# EAGLE design Preen40 (EAGLE 6.5.0)
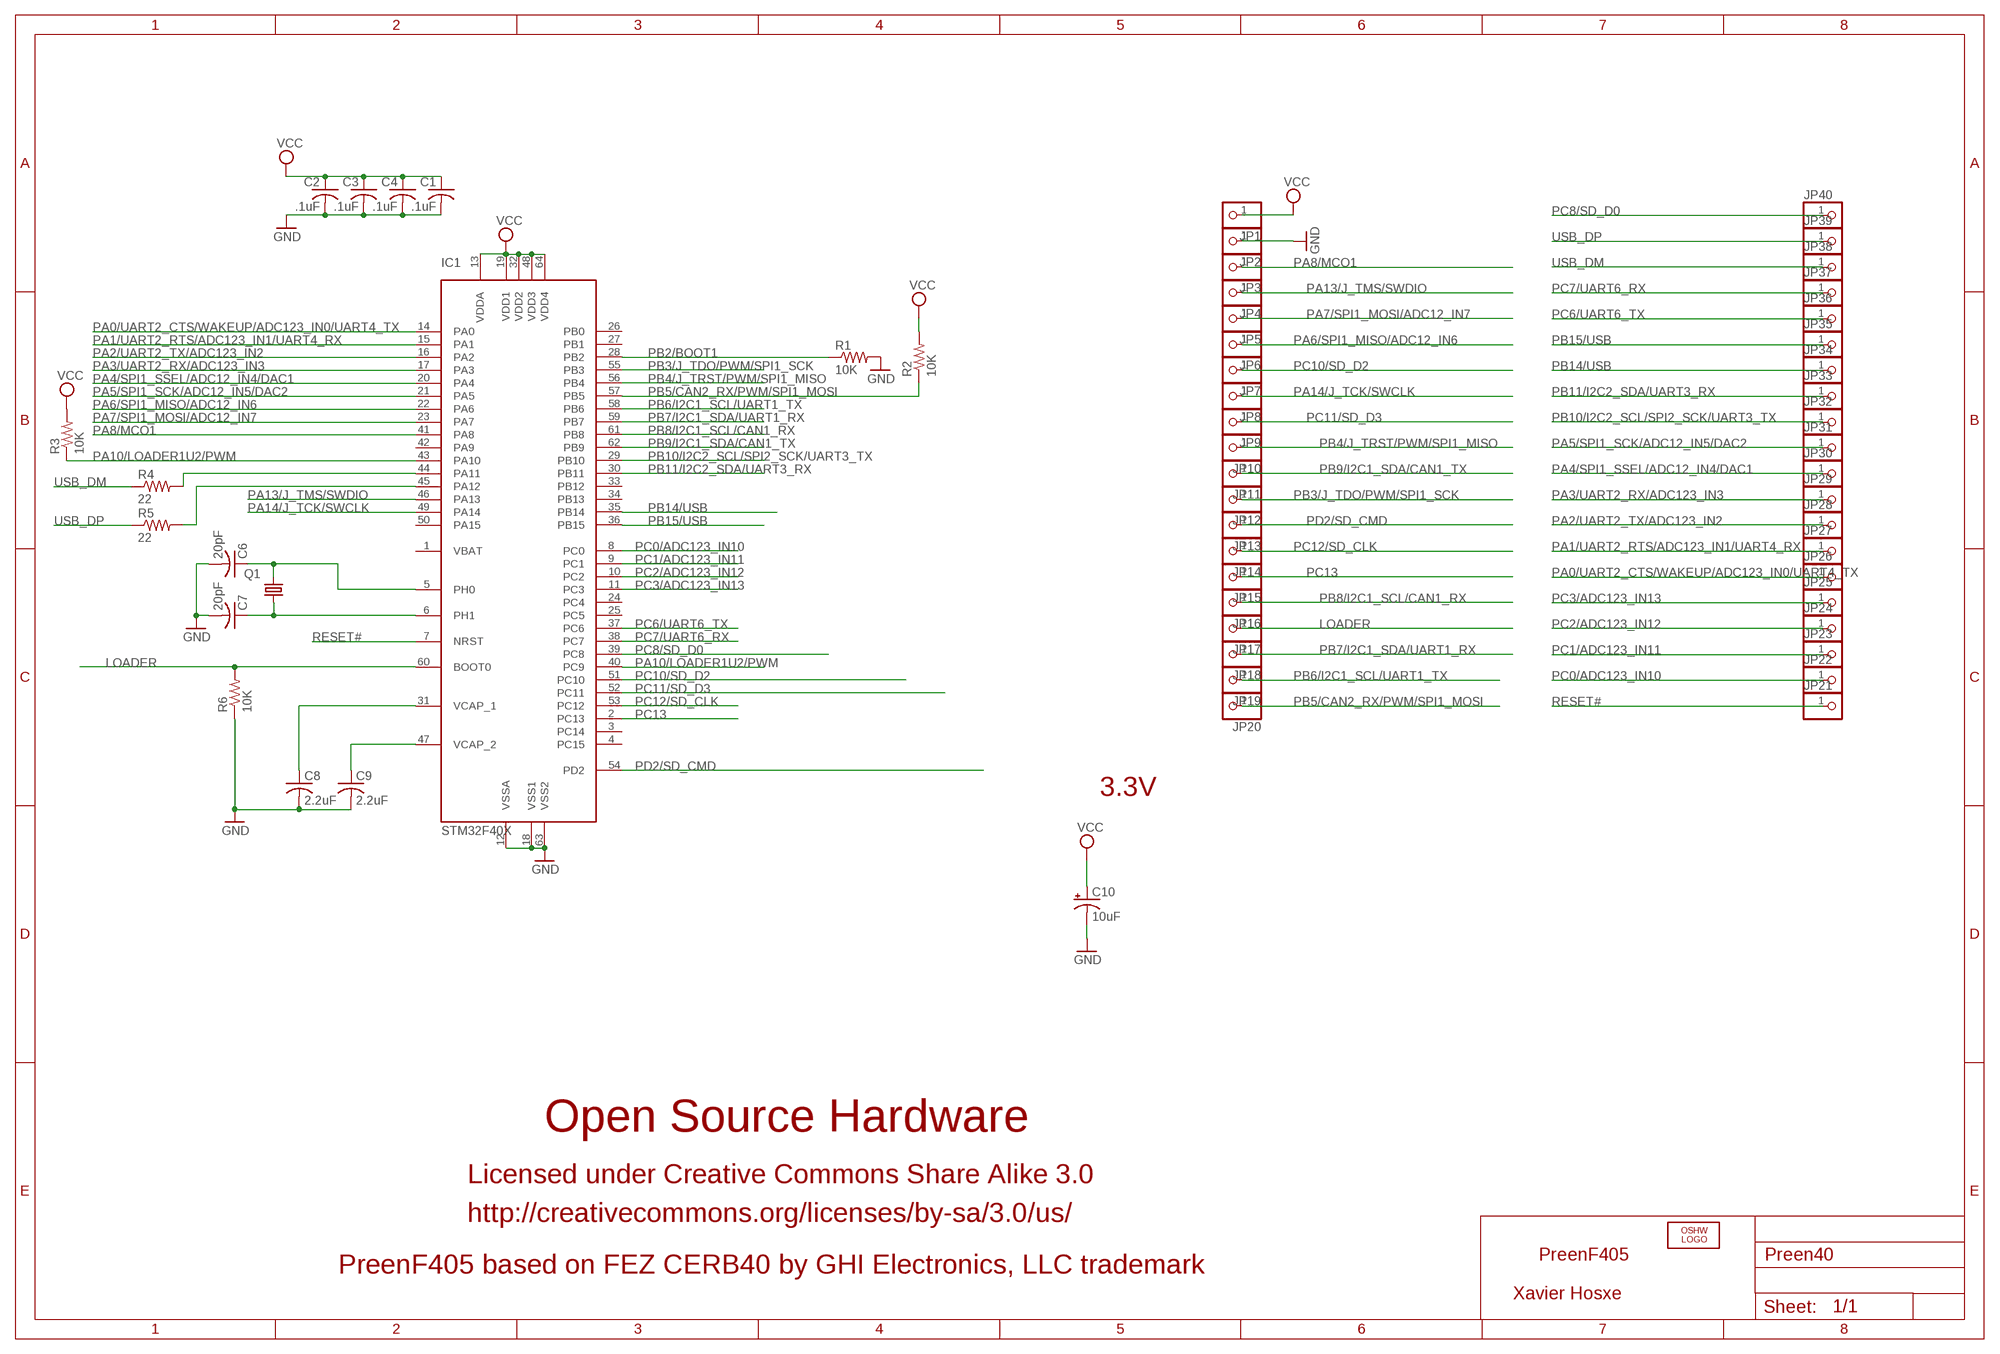
[diagram p0: schematic, sheet 1]

## Parts
C1  .1uF  C-USC0603K  [C0603K]
C2  .1uF  C-USC0603K  [C0603K]
C3  .1uF  C-USC0603K  [C0603K]
C4  .1uF  C-USC0603K  [C0603K]
C6  20pF  C-USC0603K  [C0603K]
C7  20pF  C-USC0603K  [C0603K]
C8  2.2uF  C-USC0805K  [C0805K]
C9  2.2uF  C-USC0805K  [C0805K]
C10  10uF  CPOL-USCT3528  [CT3528]
IC1  STM32F40X  [LQFP64]
JP1  PINHD-1X1  [1X01]
JP2  PINHD-1X1  [1X01]
JP3  PINHD-1X1  [1X01]
JP4  PINHD-1X1  [1X01]
JP5  PINHD-1X1  [1X01]
JP6  PINHD-1X1  [1X01]
JP7  PINHD-1X1  [1X01]
JP8  PINHD-1X1  [1X01]
JP9  PINHD-1X1  [1X01]
JP10  PINHD-1X1  [1X01]
JP11  PINHD-1X1  [1X01]
JP12  PINHD-1X1  [1X01]
JP13  PINHD-1X1  [1X01]
JP14  PINHD-1X1  [1X01]
JP15  PINHD-1X1  [1X01]
JP16  PINHD-1X1  [1X01]
JP17  PINHD-1X1  [1X01]
JP18  PINHD-1X1  [1X01]
JP19  PINHD-1X1  [1X01]
JP20  PINHD-1X1  [1X01]
JP21  PINHD-1X1  [1X01]
JP22  PINHD-1X1  [1X01]
JP23  PINHD-1X1  [1X01]
JP24  PINHD-1X1  [1X01]
JP25  PINHD-1X1  [1X01]
JP26  PINHD-1X1  [1X01]
JP27  PINHD-1X1  [1X01]
JP28  PINHD-1X1  [1X01]
JP29  PINHD-1X1  [1X01]
JP30  PINHD-1X1  [1X01]
JP31  PINHD-1X1  [1X01]
JP32  PINHD-1X1  [1X01]
JP33  PINHD-1X1  [1X01]
JP34  PINHD-1X1  [1X01]
JP35  PINHD-1X1  [1X01]
JP36  PINHD-1X1  [1X01]
JP37  PINHD-1X1  [1X01]
JP38  PINHD-1X1  [1X01]
JP39  PINHD-1X1  [1X01]
JP40  PINHD-1X1  [1X01]
LOGO1  LOGO-OSHW-FILLX0200-NT  [OSHW_FILLX200_NOTEXT]
Q1  12Mhz  CRYTALSM49  [SM49@1]
R1  10K  R-US_R0603  [R0603]
R2  10K  R-US_R0603  [R0603]
R3  10K  R-US_R0603  [R0603]
R4  22  R-US_R0603  [R0603]
R5  22  R-US_R0603  [R0603]
R6  10K  R-US_R0603  [R0603]

## Nets
GND [power]: C1.2 C2.2 C3.2 C4.2 C6.2 C7.2 C8.2 C9.2 C10.- IC1.12(VSSA) IC1.18(VSS1) IC1.63(VSS2) JP2.1 R1.2 R6.1
LOADER: IC1.60(BOOT0) JP17.1 R6.2
N$2: C9.1 IC1.47(VCAP_2)
N$3: C8.1 IC1.31(VCAP_1)
N$5: IC1.44(PA11) R4.2
N$7: IC1.45(PA12) R5.2
PA0/UART2_CTS/WAKEUP/ADC123_IN0/UART4_TX: IC1.14(PA0) JP26.1
PA1/UART2_RTS/ADC123_IN1/UART4_RX: IC1.15(PA1) JP27.1
PA2/UART2_TX/ADC123_IN2: IC1.16(PA2) JP28.1
PA3/UART2_RX/ADC123_IN3: IC1.17(PA3) JP29.1
PA4/SPI1_SSEL/ADC12_IN4/DAC1: IC1.20(PA4) JP30.1
PA5/SPI1_SCK/ADC12_IN5/DAC2: IC1.21(PA5) JP31.1
PA6/SPI1_MISO/ADC12_IN6: IC1.22(PA6) JP6.1
PA7/SPI1_MOSI/ADC12_IN7: IC1.23(PA7) JP5.1
PA8/MCO1: IC1.41(PA8) JP3.1
PA10/LOADER1U2/PWM: IC1.40(PC9) IC1.43(PA10) R3.1
PA13/J_TMS/SWDIO: IC1.46(PA13) JP4.1
PA14/J_TCK/SWCLK: IC1.49(PA14) JP8.1
PB2/BOOT1: IC1.28(PB2) R1.1
PB3/J_TDO/PWM/SPI1_SCK: IC1.55(PB3) JP12.1
PB4/J_TRST/PWM/SPI1_MISO: IC1.56(PB4) JP10.1
PB5/CAN2_RX/PWM/SPI1_MOSI: IC1.57(PB5) JP20.1 R2.1
PB6/I2C1_SCL/UART1_TX: IC1.58(PB6) JP19.1
PB7/I2C1_SDA/UART1_RX: IC1.59(PB7) JP18.1
PB8/I2C1_SCL/CAN1_RX: IC1.61(PB8) JP16.1
PB9/I2C1_SDA/CAN1_TX: IC1.62(PB9) JP11.1
PB10/I2C2_SCL/SPI2_SCK/UART3_TX: IC1.29(PB10) JP32.1
PB11/I2C2_SDA/UART3_RX: IC1.30(PB11) JP33.1
PB14/USB: IC1.35(PB14) JP34.1
PB15/USB: IC1.36(PB15) JP35.1
PC0/ADC123_IN10: IC1.8(PC0) JP22.1
PC1/ADC123_IN11: IC1.9(PC1) JP23.1
PC2/ADC123_IN12: IC1.10(PC2) JP24.1
PC3/ADC123_IN13: IC1.11(PC3) JP25.1
PC6/UART6_TX: IC1.37(PC6) JP36.1
PC7/UART6_RX: IC1.38(PC7) JP37.1
PC8/SD_D0: IC1.39(PC8) JP40.1
PC10/SD_D2: IC1.51(PC10) JP7.1
PC11/SD_D3: IC1.52(PC11) JP9.1
PC12/SD_CLK: IC1.53(PC12) JP14.1
PC13: IC1.2(PC13) JP15.1
PD2/SD_CMD: IC1.54(PD2) JP13.1
RESET#: IC1.7(NRST) JP21.1
USB_DM: JP38.1 R4.1
USB_DP: JP39.1 R5.1
VCC [power]: C1.1 C2.1 C3.1 C4.1 C10.+ IC1.13(VDDA) IC1.19(VDD1) IC1.32(VDD2) IC1.48(VDD3) IC1.64(VDD4) JP1.1 R2.2 R3.2
XTAL3: C6.1 IC1.5(PH0) Q1.2
XTAL4: C7.1 IC1.6(PH1) Q1.1
Unconnected: IC1.1(VBAT) IC1.3(PC14) IC1.4(PC15) IC1.24(PC4) IC1.25(PC5) IC1.26(PB0) IC1.27(PB1) IC1.33(PB12) IC1.34(PB13) IC1.42(PA9) IC1.50(PA15)

## Notes on the sheet
- 3.3V
- Open Source Hardware
- Licensed under Creative Commons Share Alike 3.0
- http://creativecommons.org/licenses/by-sa/3.0/us/
- PreenF405
- PreenF405 based on FEZ CERB40 by GHI Electronics, LLC trademark
- Xavier Hosxe

## Library data of the parts
C1-C4 C6-C9 = rcl:C-US: CAPACITOR, American symbol
C10 = rcl:CPOL-US: POLARIZED CAPACITOR, American symbol
IC1 = GHI:STM32F40X
JP1-JP40 = pinhead:PINHD-1X1: PIN HEADER
LOGO1 = Logo:LOGO-OSHW-FILL
Q1 = crystal:CRYTAL: CRYSTAL
R1-R6 = rcl:R-US_: RESISTOR, American symbol

## Board
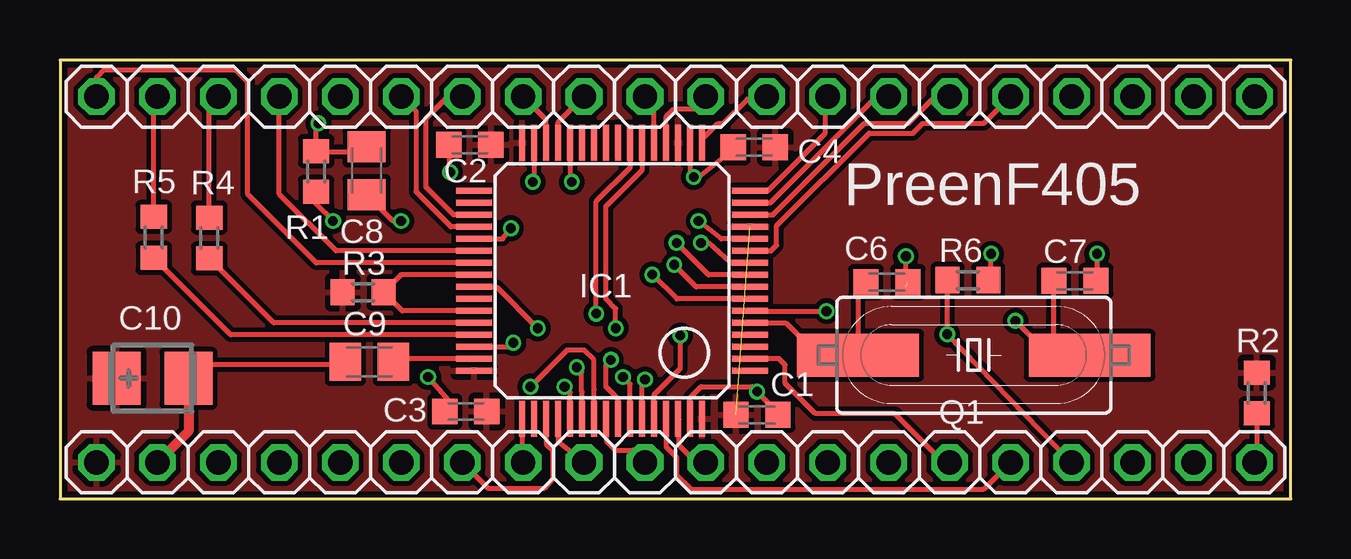
[diagram p1: board, top side]
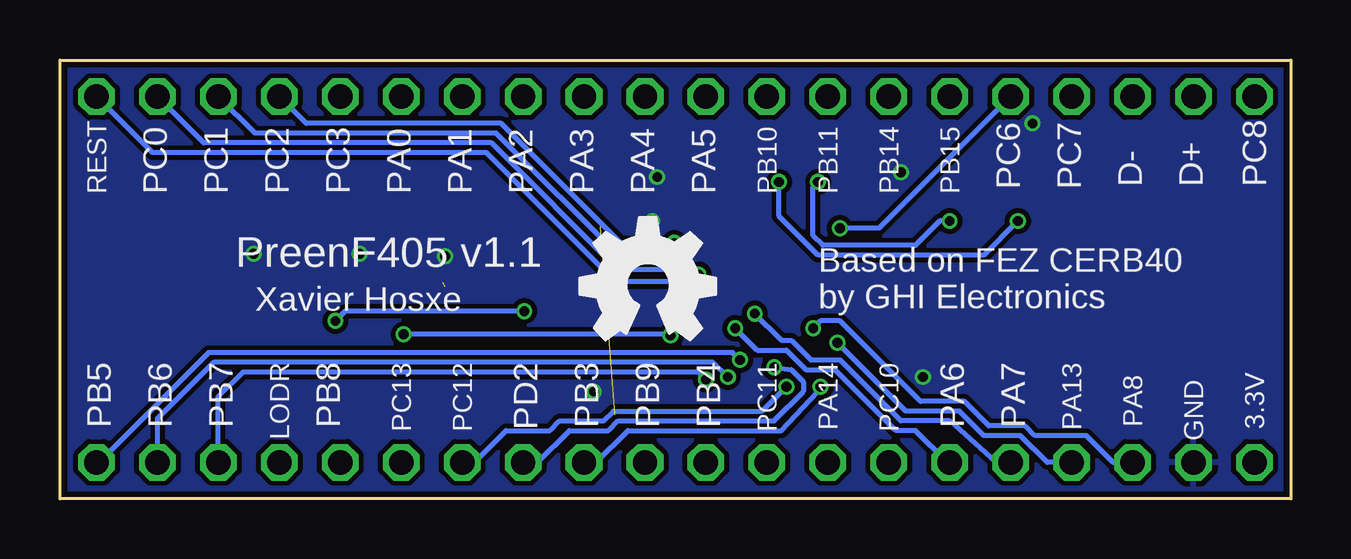
[diagram p2: board, bottom side, seen from below]

Size 51.31 x 18.29 mm. Coordinates in mm from the lower left corner, seen from the top.
Outline: 0,0 51.31,0 51.31,18.29 0,18.29 0,0
Copper layers (1+16): Top 0.035mm / dielectric 1.5mm / Bottom 0.035mm
Design rules "default *": minimum track width 6mil, minimum drill 10mil, track to track 8mil, track to pad 8mil, pad to pad 8mil, via to via 8mil, smd to smd 8mil, copper to edge 9.5mil, drill to drill 8mil, minimum pad ring 10mil, minimum via ring 5mil, stop-mask expansion 4mil, vias tented up to drill 50mil, thermal gap 10mil

### Footprints (pad centres in the part's own frame; a part is rotated, then mirrored left to right if it is on the bottom)
C0603K = smd 1.05 x 1.08: 1 -0.875,0; 2 0.875,0
C0805K = smd 1.3 x 1.6: 1 -1,0; 2 1,0
CT3528 = smd 2 x 2.2: + -1.5,0; - 1.5,0
LQFP64 = smd 0.25 x 1.5: 1 -3.75,-5.75; 2 -3.25,-5.75; 3 -2.75,-5.75; 4 -2.25,-5.75; 5 -1.75,-5.75; 6 -1.25,-5.75; 7 -0.75,-5.75; 8 -0.25,-5.75; 9 0.25,-5.75; 10 0.75,-5.75; 11 1.25,-5.75; 12 1.75,-5.75; 13 2.25,-5.75; 14 2.75,-5.75; 15 3.25,-5.75; 16 3.75,-5.75; 33 3.75,5.75; 34 3.25,5.75; 35 2.75,5.75; 36 2.25,5.75; 37 1.75,5.75; 38 1.25,5.75; 39 0.75,5.75; 40 0.25,5.75; 41 -0.25,5.75; 42 -0.75,5.75; 43 -1.25,5.75; 44 -1.75,5.75; 45 -2.25,5.75; 46 -2.75,5.75; 47 -3.25,5.75; 48 -3.75,5.75 | smd 1.5 x 0.25: 17 5.75,-3.75; 18 5.75,-3.25; 19 5.75,-2.75; 20 5.75,-2.25; 21 5.75,-1.75; 22 5.75,-1.25; 23 5.75,-0.75; 24 5.75,-0.25; 25 5.75,0.25; 26 5.75,0.75; 27 5.75,1.25; 28 5.75,1.75; 29 5.75,2.25; 30 5.75,2.75; 31 5.75,3.25; 32 5.75,3.75; 49 -5.75,3.75; 50 -5.75,3.25; 51 -5.75,2.75; 52 -5.75,2.25; 53 -5.75,1.75; 54 -5.75,1.25; 55 -5.75,0.75; 56 -5.75,0.25; 57 -5.75,-0.25; 58 -5.75,-0.75; 59 -5.75,-1.25; 60 -5.75,-1.75; 61 -5.75,-2.25; 62 -5.75,-2.75; 63 -5.75,-3.25; 64 -5.75,-3.75
1X01 = drill 1.016 octagon: 1 0,0
SM49@1 = smd 5.08 x 1.778: 1 -4.826,0; 2 4.826,0
R0603 = smd 1 x 1.1: 1 -0.85,0; 2 0.85,0

### Placement (x,y rotation side)
C1  29.06,3.51 0 top
C2  17.08,14.76 180 top
C3  16.92,3.64 180 top
C4  28.94,14.66 180 top
C6  34.47,9.03 0 top
C7  42.31,9.09 0 top
C8  12.78,13.68 90 top
C9  12.89,5.71 180 top
C10  3.86,5.03 0 top
IC1  23.02,9.09 90 top
JP1  1.52,1.52 0 top
JP2  4.06,1.52 90 top
JP3  6.6,1.52 90 top
JP4  9.14,1.52 90 top
JP5  11.68,1.52 90 top
JP6  14.22,1.52 90 top
JP7  16.76,1.52 90 top
JP8  19.3,1.52 90 top
JP9  21.84,1.52 90 top
JP10  24.38,1.52 90 top
JP11  26.92,1.52 90 top
JP12  29.46,1.52 90 top
JP13  32,1.52 90 top
JP14  34.54,1.52 90 top
JP15  37.08,1.52 90 top
JP16  39.62,1.52 90 top
JP17  42.16,1.52 90 top
JP18  44.7,1.52 90 top
JP19  47.24,1.52 90 top
JP20  49.78,1.52 90 top
JP21  49.78,16.76 0 top
JP22  47.24,16.76 0 top
JP23  44.7,16.76 0 top
JP24  42.16,16.76 0 top
JP25  39.62,16.76 0 top
JP26  37.08,16.76 0 top
JP27  34.54,16.76 0 top
JP28  32,16.76 0 top
JP29  29.46,16.76 0 top
JP30  26.92,16.76 0 top
JP31  24.38,16.76 0 top
JP32  21.84,16.76 0 top
JP33  19.3,16.76 0 top
JP34  16.76,16.76 0 top
JP35  14.22,16.76 0 top
JP36  11.68,16.76 0 top
JP37  9.14,16.76 0 top
JP38  6.6,16.76 0 top
JP39  4.06,16.76 0 top
JP40  1.52,16.76 0 top
LOGO1  29.64,6.63 0 bottom
Q1  38.09,5.99 180 top
R1  10.68,13.64 90 top
R2  49.88,4.41 90 top
R3  12.64,8.61 180 top
R4  6.22,10.87 270 top
R5  3.91,10.9 270 top
R6  37.85,9.12 180 top

### Tracks (layer width: path | path; a pad name or v marks a point on that pad's centre or on a via)
GND  (via drill 0.41)  (1 unrouted)
  Top 0.203: 29.96,3.48 C1.2 29.93,3.6 v29.06,4.47 28.85,4.67 26.72,4.67 26.27,4.22 IC1.63 | C4.2 27.64,14.22 26.62,13.41 v26.42,13.41 26.27,13.56 IC1.18 | IC1.12 27.57,10.84 v26.62,11.58 | C2.2 16.21,13.66 v16.26,13.61 | v10.77,15.65 10.68,15.54 R1.2 10.79,14.47 12.58,14.47 C8.2 | C3.2 16.25,4.08 v15.34,5.08 | R6.1 38.81,9.03 v38.81,10.21 | C7.2 43.23,8.93 v43.23,10.21 | 35.26,8.84 v35.26,10.11 | C9.2 arc-90 11.77,5.59 5.49,5.59 arc90 5.36,5.46 C10.-
  Top 0.406: C10.- 5.36,2.82 JP2.1
  pour Bottom (rank 2): 51.61,18.59 51.61,-0.41 -0.3,-0.41 -0.3,18.59
LOADER  (via drill 0.41)
  Top 0.203: IC1.60 24.77,4.35 25.86,5.44 v25.86,6.81 | 37.08,9.03 R6.2 37,6.87 v36.98,6.86 JP17.1
  Bottom 0.203: v25.86,6.81 25.91,6.86 v36.98,6.86
N$2
  Top 0.203: IC1.47 14.02,5.84 arc90 C9.1
N$3  (via drill 0.41)
  Top 0.203: 13.33,12.47 C8.1 13.87,11.58 v14.22,11.58 | IC1.31 19.77,13.27 v19.71,13.21
  Bottom 0.203: v14.22,11.58 14.63,11.58 15.65,10.57 19.51,10.57 19.91,10.97 19.91,13.01 v19.71,13.21
N$5
  Top 0.203: IC1.44 8.91,7.34 R4.2
N$7
  Top 0.203: IC1.45 7.12,6.84 R5.2
PA0/UART2_CTS/WAKEUP/ADC123_IN0/UART4_TX
  Top 0.203: IC1.14 29.72,11.84 33.53,15.65 35.36,15.65 36.37,16.66 36.98,16.66 JP26.1
PA1/UART2_RTS/ADC123_IN1/UART4_RX
  Top 0.203: IC1.15 29.61,12.34 33.93,16.66 34.44,16.66 JP27.1
PA2/UART2_TX/ADC123_IN2
  Top 0.203: IC1.16 29.5,12.84 31.9,15.24 31.9,16.66 JP28.1
PA3/UART2_RX/ADC123_IN3
  Top 0.203: IC1.17 26.77,14.98 27.43,15.65 27.64,15.65 28.65,16.66 29.36,16.66 JP29.1
PA4/SPI1_SSEL/ADC12_IN4/DAC1
  Top 0.203: IC1.20 25.27,15.92 25.6,16.26 26.42,16.26 JP30.1
PA5/SPI1_SCK/ADC12_IN5/DAC2
  Top 0.203: IC1.21 24.77,16.38 JP31.1
PA6/SPI1_MISO/ADC12_IN6  (via drill 0.41)
  Top 0.203: v23.16,7.11 23.16,7.92 22.76,8.33 22.76,12.19 24.27,13.7 IC1.22
  Bottom 0.203: JP6.1 14.33,1.52 15.65,2.85 16.46,2.85 19,5.38 20.22,5.38 21.03,6.2 22.25,6.2 v23.16,7.11
PA7/SPI1_MOSI/ADC12_IN7  (via drill 0.41)
  Top 0.203: v22.35,7.72 22.35,12.39 23.77,13.82 IC1.23
  Bottom 0.203: JP5.1 12.29,1.52 14.22,3.25 16.26,3.25 18.8,5.79 20.02,5.79 20.83,6.6 21.23,6.6 v22.35,7.72
PA8/MCO1  (via drill 0.41)
  Top 0.203: IC1.41 18.19,8.84 v19.91,7.11
  Bottom 0.203: JP3.1 7.42,1.52 8.53,2.64 10.67,2.64 11.07,3.05 12.6,3.05 13.61,4.06 15.44,4.06 18.8,7.42 19.61,7.42 v19.91,7.11
PA10/LOADER1U2/PWM
  Top 0.203: IC1.43 14.26,7.84 R3.1 14.22,9.34 IC1.40
PA13/J_TMS/SWDIO  (via drill 0.41)
  Top 0.203: IC1.46 18.73,6.34 v18.9,6.5
  Bottom 0.203: JP4.1 10.16,1.52 11.28,2.64 12.8,2.64 13.82,3.66 16.05,3.66 v18.9,6.5
PA14/J_TCK/SWCLK
  Top 0.203: IC1.49 19.27,1.56 JP8.1
PB2/BOOT1  (via drill 0.41)
  Top 0.203: IC1.28 21.27,13.28 v21.34,13.21 | v11.38,11.58 10.68,12.29 R1.1
  Bottom 0.203: v21.34,13.21 21.34,11.79 19.71,10.16 12.8,10.16 v11.38,11.58
PB3/J_TDO/PWM/SPI1_SCK  (via drill 0.41)
  Top 0.203: IC1.55 22.27,4.55 22.25,4.67 22.25,5.79 21.84,6.2 21.13,6.2 v19.61,4.67
  Bottom 0.203: JP12.1 28.96,1.52 27.64,2.85 21.23,2.85 19.71,4.47 v19.61,4.67
PB4/J_TRST/PWM/SPI1_MISO
  Top 0.203: IC1.56 22.77,2.43 23.16,2.03 23.88,2.03 JP10.1
PB5/CAN2_RX/PWM/SPI1_MOSI  (via drill 0.41)
  Top 0.203: R2.1 49.88,1.62 JP20.1 | IC1.57 23.27,4.16 22.76,4.67 22.76,5.59 v22.96,5.79
  Bottom 0.203: JP20.1 49.68,1.52 45.11,6.1 23.27,6.1 v22.96,5.79
PB6/I2C1_SCL/UART1_TX  (via drill 0.41)
  Top 0.203: IC1.58 23.77,4.78 v23.47,5.08
  Bottom 0.203: JP19.1 47.24,3.35 44.91,5.69 24.08,5.69 v23.47,5.08
PB7/I2C1_SDA/UART1_RX  (via drill 0.41)
  Top 0.203: IC1.59 24.27,4.86 v24.38,4.98
  Bottom 0.203: JP18.1 44.7,4.27 43.69,5.28 24.69,5.28 v24.38,4.98
PB8/I2C1_SCL/CAN1_RX
  Top 0.203: IC1.61 25.27,2.16 25.7,1.73 25.7,1.02 26.31,0.41 38.51,0.41 JP16.1
PB9/I2C1_SDA/CAN1_TX
  Top 0.203: JP11.1 26.52,1.52 25.81,2.23 25.81,3.3 IC1.62
PB10/I2C2_SCL/SPI2_SCK/UART3_TX
  Top 0.203: IC1.29 20.77,15.69 JP32.1
PB11/I2C2_SDA/UART3_RX
  Top 0.203: IC1.30 20.27,15.8 JP33.1
PB14/USB
  Top 0.203: JP34.1 16.15,16.76 15.24,15.85 15.24,13.01 16.41,11.84 IC1.35
PB15/USB
  Top 0.203: IC1.36 16.3,11.34 14.83,12.8 14.83,16.15 JP35.1
PC0/ADC123_IN10  (via drill 0.41)
  Top 0.203: IC1.8 26.52,8.84 v25.6,9.75
  Bottom 0.203: v25.6,9.75 25.81,9.55 28.04,9.55 33.33,14.83 45.31,14.83 JP22.1
PC1/ADC123_IN11  (via drill 0.41)
  Top 0.203: IC1.9 27.04,9.34 v25.7,10.67
  Bottom 0.203: JP23.1 43.18,15.24 33.12,15.24 27.84,9.96 26.42,9.96 v25.7,10.67
PC2/ADC123_IN12  (via drill 0.41)
  Top 0.203: IC1.10 27.96,9.84 27.03,10.67 v26.72,10.67
  Bottom 0.203: v26.72,10.67 27.94,10.67 32.92,15.65 41.05,15.65 JP24.1
PC3/ADC123_IN13
  Top 0.203: IC1.11 29.64,10.34 29.87,10.57 29.87,11.38 33.73,15.24 35.56,15.24 35.97,15.65 38.51,15.65 JP25.1
PC6/UART6_TX  (via drill 0.41)
  Top 0.203: IC1.37 18.46,10.84 v18.8,11.28
  Bottom 0.203: JP36.1 17.17,11.28 v18.8,11.28
PC7/UART6_RX
  Top 0.203: IC1.38 11.51,10.34 9.14,12.7 JP37.1
PC8/SD_D0
  Top 0.203: IC1.39 10.69,9.84 7.82,12.7 7.82,17.37 7.32,17.88 1.83,17.88 1.52,17.58 JP40.1
PC10/SD_D2
  Top 0.203: IC1.51 20.27,2.29 20.52,2.03 20.52,0.81 20.17,0.43 17.86,0.43 JP7.1
PC11/SD_D3
  Top 0.203: IC1.52 20.77,2.4 JP9.1
PC12/SD_CLK  (via drill 0.41)
  Top 0.203: IC1.53 21.27,4.44 v21.03,4.67
  Bottom 0.203: JP14.1 34.04,1.52 32.72,2.85 30.89,2.85 30.48,3.25 28.65,3.25 28.25,3.66 22.05,3.66 v21.03,4.67
PC13
  Top 0.203: JP15.1 36.83,1.52 34.8,3.56 31.5,3.56 30.23,4.83 30.23,5.59 29.97,5.84 IC1.2
PD2/SD_CMD  (via drill 0.41)
  Top 0.203: IC1.54 21.77,4.45 21.74,4.47 21.74,5.28 v21.54,5.49
  Bottom 0.203: JP13.1 31.39,1.52 30.07,2.85 28.45,2.85 28.04,3.25 21.54,3.25 20.32,4.47 20.32,4.88 20.83,5.38 v21.54,5.49
RESET#  (via drill 0.41)
  Top 0.203: IC1.7 25.71,8.34 v24.69,9.35
  Bottom 0.203: JP21.1 47.45,14.43 33.53,14.43 28.14,9.04 24.99,9.04 v24.69,9.35
USB_DM
  Top 0.203: R4.1 6.22,16.38 JP38.1
USB_DP
  Top 0.203: R5.1 3.91,16.61 JP39.1
VCC  (1 unrouted)
  pour Top: -0.41,18.8 51.82,18.8 51.82,-0.41 -0.41,-0.41
XTAL3
  Top 0.203: Q1.2 35.56,6.23 | C6.1 33.27,8.71 Q1.2 | IC1.5 30.25,7.34 31.5,6.1 Q1.2
XTAL4  (via drill 0.41)
  Top 0.203: C7.1 41.4,9.05 41.4,5.84 | 41.4,5.84 41.66,5.84 Q1.1 | 41.4,5.84 v39.83,7.42 | IC1.6 28.77,7.82 v31.95,7.82
  Bottom 0.203: v31.95,7.82 39.42,7.82 v39.83,7.42

### Text on the board
tPlace: PreenF405
bPlace: PC8 | D+ | D- | PC7 | PC6 | PB15 | PB14 | PB11 | PB10 | PA5 | PA4 | PA3 | PA2 | PA1 | PA0 | PC3 | PC2 | PC1 | PC0 | REST | PreenF405 v1.1 | Based on FEZ CERB40 / by GHI Electronics | Xavier Hosxe | PA13 | PA7 | PA6 | PC10 | PA14 | PC11 | PB4 | PB9 | PB3 | PD2 | PC12 | PC13 | PB8 | LODR | PB7 | PB6 | PB5 | 3.3V | GND | PA8